# Altium schematic sheet Simulation 1.SchDoc: Panel Mode Enable Simulation
size A4; ApprovedBy: LD Stanton; Author: LD Stanton; CompanyName: University of Cape Town; DrawnBy: Lawrence Stanton; Engineer: Lawrence Stanton; Organization: University of Cape Town; Address1: Department of Electrical Engineering; Address2: Rondebosch; Address3: Cape Town; Address4: South Africa 7701; DocumentNumber: 20; SheetNumber: 20; SheetTotal: 20
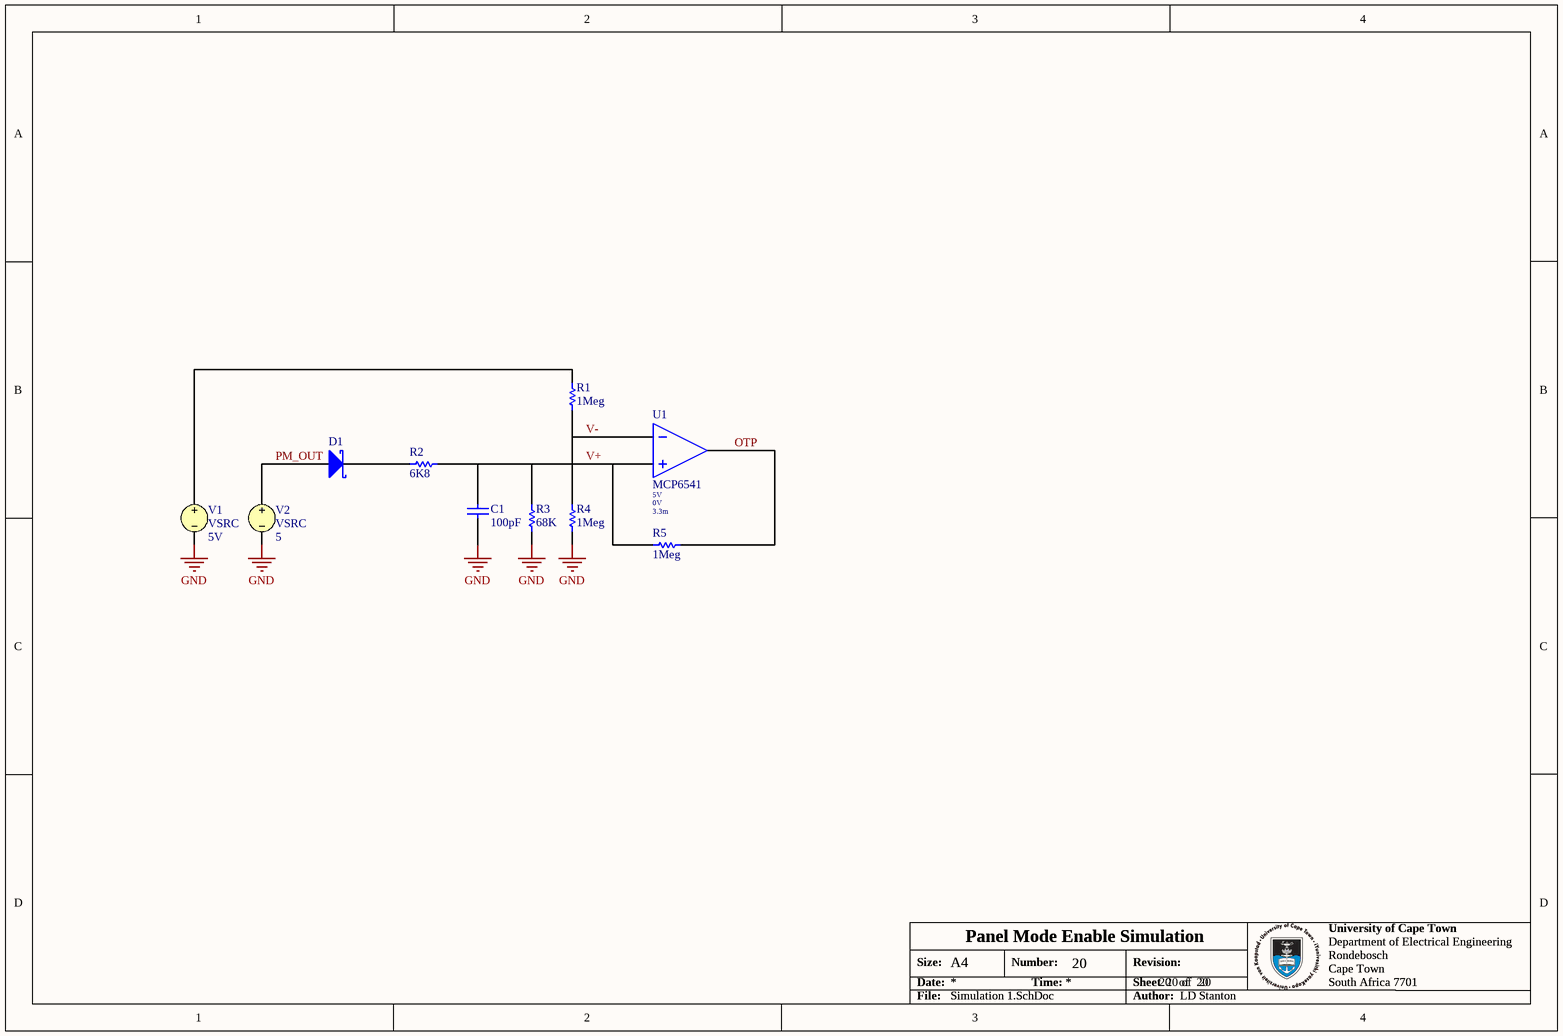
[diagram p0: Simulation 1.SchDoc]

## Parts
C1  value 100pF  (hidden comment: Capacitor)
D1  Shottky Diode  (value not drawn)
R1  value 1Meg  (hidden comment: Resistor)
R2  value 6K8  (hidden comment: Resistor)
R3  value 68K  (hidden comment: Resistor)
R4  value 1Meg  (hidden comment: Resistor)
R5  value 1Meg  (hidden comment: Resistor)
U1  MCP6541  VHIGH: 5V  VLOW: 0V  VHYS: 3.3m
V1  VSRC  value 5V
V2  VSRC  DC Magnitude: 5

## Nets
GND: C1.1 R3.1 R4.1 V1.2 V2.2
OTP: R5.2 U1.3(OUT)
PM_OUT: D1.1(A) V2.1
V+: C1.2 R2.2 R3.2 R5.1 U1.2(IN+)
V-: R1.1 R4.2 U1.1(IN-)
NetD1_2: D1.2(K) R2.1
NetR1_2: R1.2 V1.1

## Notes on the sheet
- Size:
- Date:
- A4
- Number:
- Time:
- Revision:
- Sheet
- of
- File:
- Author:

## Library data of the parts
C1 = Capacitor: SimulationGenericComponent: True
D1 = Shottky Diode: AF: 1; BV: 0; BV_MAX: 1e99; EG: 1.11; FC: 0.5; IBV: 0.001; IS: 1e-14; MJSW: 0.33; NTUN: 30; TNOM: 27; VJ: 0.3; XTI: 3; SimulationGenericComponent: True; CJO: 0; CJP: 0; CTA: 0; CTP: 0; FCS: 0.5; FV_MAX: 1e99; IKF: 0; IKR: 0; ISR: 1e-14; JSW: 0; JTUN: 0; JTUNSW: 0; KEG: 1; KF: 0; LEVEL: 1; N: 1; NBV: 1; NR: 1; NS: 1; PHP: 1; RS: 0; TCV: 0; TLEV: 0; TLEVC: 0; TM1: 0; TM2: 0; TPB: 0; TPHP: 0; TRS: 0; TRS2: 0; TT: 0; TTT1: 0; TTT2: 0; XTITUN: 3
R1-R5 = Resistor: TC1: 0; SimulationGenericComponent: True; TC2: 0
U1 = Comparator: Ideal Comparator; SimulationGenericComponent: True
V1 = VSRC: Voltage Source; Note: PCB Footprint - Not required; AC Magnitude: 0; Published: 30-July-2020; LatestRevisionDate: 30-July-2020; LatestRevisionNote: Re-released for DXP Platform.; PackageReference: Not Applicable; Publisher: Altium Limited; AC Phase: 0
V2 = VSRC: Voltage Source; Note: PCB Footprint - Not required; AC Magnitude: 0; Time-Value Pairs: 0 0 1.136u 0 1.137u 5 2.272u 5 2.273u 0 3.409u 0 3.410u 5 4.545u 5 4.546u 0 5.681u 0 5.682u 5 6.818u 5 6.819u 0 7.955u 0 7.956u 5 9.09u 5 9.10u 0 13u 0; Published: 30-July-2020; LatestRevisionDate: 30-July-2020; LatestRevisionNote: Re-released for DXP Platform.; PackageReference: Not Applicable; Publisher: Altium Limited; AC Phase: 0